# Altium project Raumluftsensor.PrjPcb
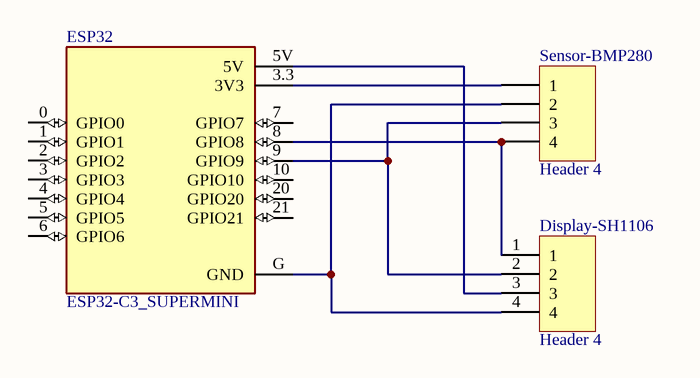
[diagram p0: Raumluftsensor.SchDoc]
1 sheet, 3 parts. Net scope: global (net labels, ports and power ports of the same name join across sheets).
Board file: Raumluftsensor.PcbDoc

## Sheet Raumluftsensor.SchDoc
size A4; DocumentNumber: 1; Revision: 0.1; SheetNumber: 1; SheetTotal: 1; HTL_Gruppe: I; HTL_Klasse: Klasse; HTL_Zusaetzlicher_Titel: zusätzlicher Titel; HTL_Schueler_Name: Max Mustermann; PageSetup: Record=PageOptions|CenterHorizontal=True|CenterVertical=True|PrintScale=1.00|XCorrection=1.00|YCorrection=1.00|PrintKind=0|BorderSize=5000000|LeftOffset=0|BottomOffset=0|Orientation=2|PaperLength=1000|PaperWidth=1000|Scale=100|PaperSource=7|PrintQuality=-4|MediaType=1|DitherType=10|PaperKind=A4|PrintScaleMode=1; HTL_Projektname: Projektname; HTL_Dokumentenart: Dokumentenart; HTL_Dokumentenstatus: Dokumentenstatus

### Parts
Display-SH1106  Header 4  [HDR1X4]
ESP32  ESP32-C3_SUPERMINI  [MODULE_ESP32-C3_SUPERMINI]
Sensor-BMP280  Header 4  [HDR1X4]

### Nets
NetDisplay-SH1106_1: Display-SH1106.1 ESP32.8(GPIO8) Sensor-BMP280.4
NetDisplay-SH1106_2: Display-SH1106.2 ESP32.9(GPIO9) Sensor-BMP280.3
NetDisplay-SH1106_3: Display-SH1106.3 ESP32.5V
NetDisplay-SH1106_4: Display-SH1106.4 ESP32.G(GND) Sensor-BMP280.2
NetESP32_3.3: ESP32.3.3(3V3) Sensor-BMP280.1

Not connected (* = marked no-connect by the designer): ESP32 0(GPIO0) 1(GPIO1) 2(GPIO2) 3(GPIO3) 4(GPIO4) 5(GPIO5) 6(GPIO6) 7(GPIO7) 10(GPIO10) 20(GPIO20) 21(GPIO21)

### Notes on the sheet
- Sachnummer / Dateiname:
- Name:
- Gruppe:
- Klasse:
- Elektronik &
- Technische Informatik
- Anichstraße 26 - 28
- HTBLVA
- Titel:
- Datum:
- Dokumentenart:
- Dokumentenstatus:
- A - 6020 Innsbruck
- Ver.:
- Blatt:
- Blätter:

### Library data of the parts
Display-SH1106 Sensor-BMP280 = Header 4: Header, 4-Pin; LatestRevisionDate: 17-Jul-2002; LatestRevisionNote: Re-released for DXP Platform.; Publisher: Altium Limited
ESP32 = ESP32-C3_SUPERMINI_TH: Super tiny ESP32-C3 board; MF: Espressif Systems; MP: ESP32-C3 SuperMini_TH; SnapEDA_Link: https://www.snapeda.com/parts/ESP32-C3%20SuperMini_TH/Espressif+Systems/view-part/?ref=snap; Package: Package; Value: *; Check_prices: https://www.snapeda.com/parts/ESP32-C3%20SuperMini_TH/Espressif+Systems/view-part/?ref=eda